# EAGLE design cpu_base (EAGLE 9.0.0)

## Sheet 1 of 2
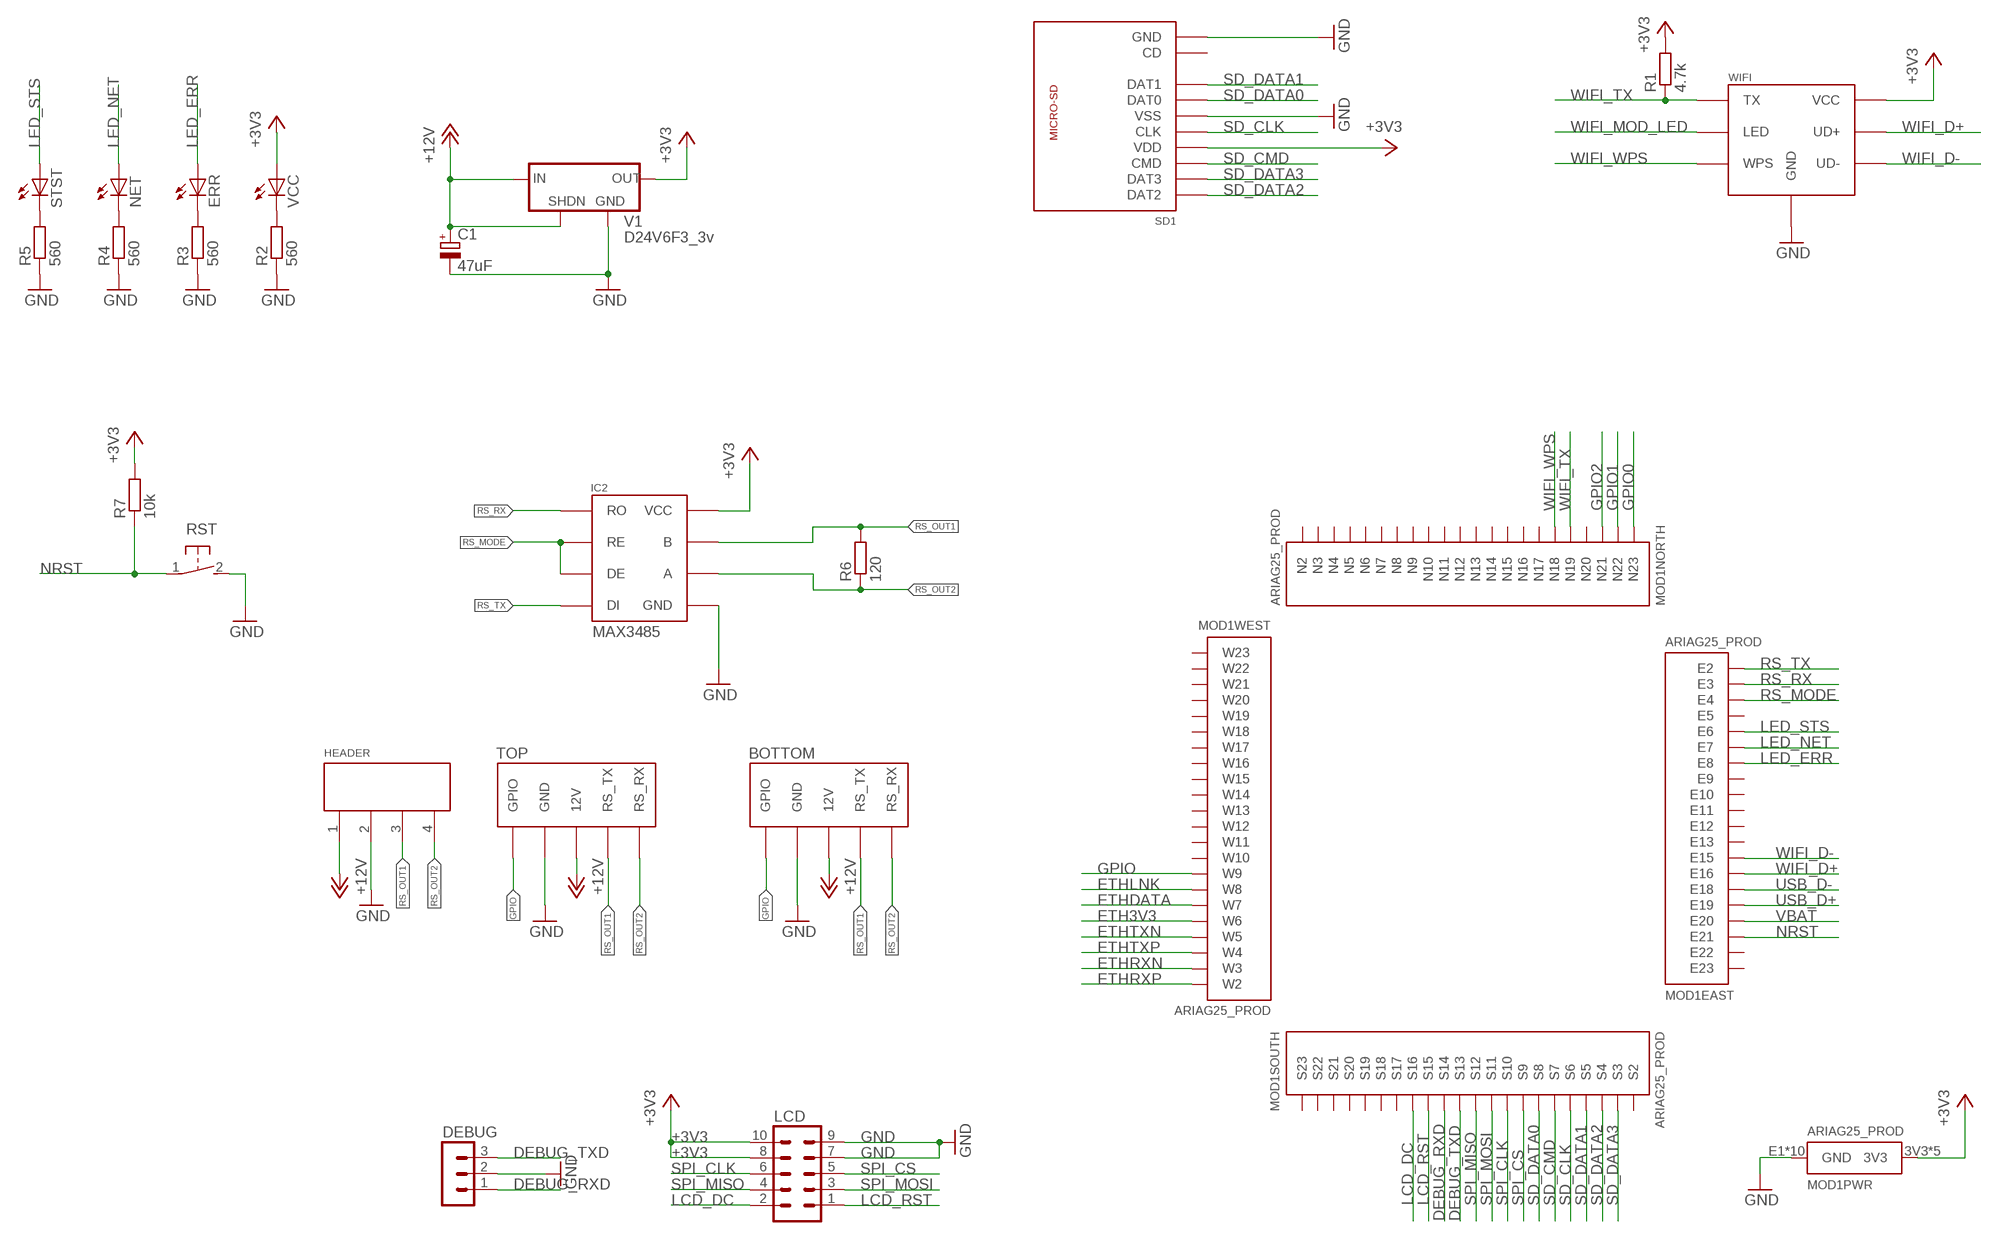
[diagram p0: schematic, sheet 1]

### Parts
BOTTOM  STEROWNIK-PINY_5PIN_BOTTOM  [STEROWNIK-PINY_5PIN_BOTTOM]
C1  47uF  CPOL-EU153CLV-0810  [153CLV-0810]
DEBUG  MA03-1  [MA03-1]
ERR  LEDCHIPLED_0805  [CHIPLED_0805]
HEADER  TBMP5104RO-KF  [TBMP5104RO-KF]
IC2  MAX3485  [SO-8]
LCD  MA05-2  [MA05-2]
MOD1  ARIAG25_PROD  [G25_D]
NET  LEDCHIPLED_0805  [CHIPLED_0805]
R1  4.7k  R-EU_R0805  [R0805]
R2  560  R-EU_R0805  [R0805]
R3  560  R-EU_R0805  [R0805]
R4  560  R-EU_R0805  [R0805]
R5  560  R-EU_R0805  [R0805]
R6  120  R-EU_R0805  [R0805]
R7  10k  R-EU_R0805  [R0805]
RST  31-XX  [B3F-31XX]
SD1  MICRO-SD  [112I-TDAR-R]
STST  LEDCHIPLED_0805  [CHIPLED_0805]
TOP  STEROWNIK-PINY_5PIN  [STEROWNIK-PINY_5PIN]
V1  D24V6F3_3v  D24V6F5_5V  [D24V6F5_5V]
VCC  LEDCHIPLED_0805  [CHIPLED_0805]
WIFI  WIFI-2-OEM  [WIFI]

### Nets
+3V3: IC2.VCC LCD.8 LCD.10 MOD1.3V3(PWR:3V3) MOD1.E24(PWR:3V3) MOD1.N1(PWR:3V3) MOD1.S1(PWR:3V3) MOD1.W24(PWR:3V3) R1.2 R7.2 SD1.4(VDD) V1.VOUT(OUT) VCC.A WIFI.VCC
+12V: BOTTOM.12(12V) C1.+ HEADER.1 TOP.12V V1.SHDN V1.VIN(IN)
DEBUG_RXD: DEBUG.1 MOD1.S14(SOUTH:S14)
DEBUG_TXD: DEBUG.3 MOD1.S13(SOUTH:S13)
ETH3V3: MOD1.W6(WEST:W6)
ETHDATA: MOD1.W7(WEST:W7)
ETHLNK: MOD1.W8(WEST:W8)
ETHRXN: MOD1.W3(WEST:W3)
ETHRXP: MOD1.W2(WEST:W2)
ETHTXN: MOD1.W5(WEST:W5)
ETHTXP: MOD1.W4(WEST:W4)
GND: BOTTOM.GND C1.- DEBUG.2 HEADER.2 IC2.GND LCD.7 LCD.9 MOD1.E1(PWR:GND) MOD1.E14(PWR:GND) MOD1.E17(PWR:GND) MOD1.GND@1(PWR:GND) MOD1.GND@2(PWR:GND) MOD1.GND@4(PWR:GND) MOD1.GND@5(PWR:GND) MOD1.N24(PWR:GND) MOD1.S24(PWR:GND) MOD1.W1(PWR:GND) R2.1 R3.1 R4.1 R5.1 RST.2(S) SD1.6(VSS) SD1.GND_A(GND) SD1.GND_B(GND) SD1.GND_C(GND) TOP.GND V1.GND WIFI.GND
GPIO: BOTTOM.GPIO1(GPIO) MOD1.W9(WEST:W9) TOP.GPIO1(GPIO)
GPIO0: MOD1.N23(NORTH:N23)
GPIO1: MOD1.N22(NORTH:N22)
GPIO2: MOD1.N21(NORTH:N21)
LCD_DC: LCD.2 MOD1.S16(SOUTH:S16)
LCD_RST: LCD.1 MOD1.S15(SOUTH:S15)
LED_ERR: ERR.A MOD1.E8(EAST:E8)
LED_NET: MOD1.E7(EAST:E7) NET.A
LED_STS: MOD1.E6(EAST:E6) STST.A
N$6: R2.2 VCC.C
N$7: ERR.C R3.2
N$9: NET.C R4.2
N$10: R5.2 STST.C
NRST: MOD1.E21(EAST:E21) R7.1 RST.1(P)
RS_MODE: IC2.DE IC2.RE MOD1.E4(EAST:E4)
RS_OUT1: BOTTOM.RS_TX HEADER.3 IC2.B R6.2 TOP.RS_TX
RS_OUT2: BOTTOM.RS_RX HEADER.4 IC2.A R6.1 TOP.RS_RX
RS_RX: IC2.RO MOD1.E3(EAST:E3)
RS_TX: IC2.DI MOD1.E2(EAST:E2)
SD_CLK: MOD1.S6(SOUTH:S6) SD1.5(CLK)
SD_CMD: MOD1.S7(SOUTH:S7) SD1.3(CMD)
SD_DATA0: MOD1.S8(SOUTH:S8) SD1.7(DAT0)
SD_DATA1: MOD1.S5(SOUTH:S5) SD1.8(DAT1)
SD_DATA2: MOD1.S4(SOUTH:S4) SD1.1(DAT2)
SD_DATA3: MOD1.S3(SOUTH:S3) SD1.2(DAT3)
SPI_CLK: LCD.6 MOD1.S10(SOUTH:S10)
SPI_CS: LCD.5 MOD1.S9(SOUTH:S9)
SPI_MISO: LCD.4 MOD1.S12(SOUTH:S12)
SPI_MOSI: LCD.3 MOD1.S11(SOUTH:S11)
USB_D+: MOD1.E19(EAST:E19)
USB_D-: MOD1.E18(EAST:E18)
VBAT: MOD1.E20(EAST:E20)
WIFI_D+: MOD1.E16(EAST:E16) WIFI.UD+
WIFI_D-: MOD1.E15(EAST:E15) WIFI.UD-
WIFI_MOD_LED: WIFI.LED
WIFI_TX: MOD1.N19(NORTH:N19) R1.1 WIFI.TX
WIFI_WPS: MOD1.N18(NORTH:N18) WIFI.WPS
Unconnected: MOD1.E5(EAST:E5) MOD1.E9(EAST:E9) MOD1.E10(EAST:E10) MOD1.E11(EAST:E11) MOD1.E12(EAST:E12) MOD1.E13(EAST:E13) MOD1.E22(EAST:E22) MOD1.E23(EAST:E23) MOD1.N2(NORTH:N2) MOD1.N3(NORTH:N3) MOD1.N4(NORTH:N4) MOD1.N5(NORTH:N5) MOD1.N6(NORTH:N6) MOD1.N7(NORTH:N7) MOD1.N8(NORTH:N8) MOD1.N9(NORTH:N9) MOD1.N10(NORTH:N10) MOD1.N11(NORTH:N11) MOD1.N12(NORTH:N12) MOD1.N13(NORTH:N13) MOD1.N14(NORTH:N14) MOD1.N15(NORTH:N15) MOD1.N16(NORTH:N16) MOD1.N17(NORTH:N17) MOD1.N20(NORTH:N20) MOD1.S2(SOUTH:S2) MOD1.S17(SOUTH:S17) MOD1.S18(SOUTH:S18) MOD1.S19(SOUTH:S19) MOD1.S20(SOUTH:S20) MOD1.S21(SOUTH:S21) MOD1.S22(SOUTH:S22) MOD1.S23(SOUTH:S23) MOD1.W10(WEST:W10) MOD1.W11(WEST:W11) MOD1.W12(WEST:W12) MOD1.W13(WEST:W13) MOD1.W14(WEST:W14) MOD1.W15(WEST:W15) MOD1.W16(WEST:W16) MOD1.W17(WEST:W17) MOD1.W18(WEST:W18) MOD1.W19(WEST:W19) MOD1.W20(WEST:W20) MOD1.W21(WEST:W21) MOD1.W22(WEST:W22) MOD1.W23(WEST:W23) SD1.CD

### Notes on the sheet
- MAX3485

## Sheet 2 of 2

## Library data of the parts
BOTTOM = pcb:STEROWNIK-PINY_5PIN_BOTTOM
C1 = rcl:CPOL-EU: POLARIZED CAPACITOR, European symbol
DEBUG = con-lstb:MA03-1: PIN HEADER; OC_FARNELL: unknown; OC_NEWARK: unknown
ERR NET STST VCC = led:LED: LED OSRAM: - CHIPLED LG R971, LG N971, LY N971, LG Q971, LY Q971, LO R971, LY R971 LH N974, LH R974 LS Q976, LO Q976, LY Q976 LO Q996 - Hyper CHIPLED LW Q18S LB Q993, LB Q99A, LB R99A - SideLED LS A670, LO A670, LY A670, LG A670, LP A670 LB A673, LV A673, LT A673, LW A673 LH A674 LY A675 LS A676, LA A676, LO A676, LY A676, LW A676 LS A679, LY A679, LG A679 - Hyper Micro SIDELED® LS Y876, LA Y876, LO Y876, LY Y876 LT Y87S - SmartLED LW L88C, LW L88S LB L89C, LB L89S, LG L890 LS L89K, LO L89K, LY L89K LS L896, LA L896, LO L896, LY L896 - TOPLED LS T670, LO T670, LY T670, LG T670, LP T670 LSG T670, LSP T670, LSY T670, LOP T670, LYG T670 LG T671, LOG T671, LSG T671 LB T673, LV T673, LT T673, LW T673 LH T674 LS T676, LA T676, LO T676, LY T676, LB T676, LH T676, LSB T676, LW T676 LB T67C, LV T67C, LT T67C, LS T67K, LO T67K, LY T67K, LW E67C LS E67B, LA E67B, LO E67B, LY E67B, LB E67C, LV E67C, LT E67C LW T67C LS T679, LY T679, LG T679 LS T770, LO T770, LY T770, LG T770, LP T770 LB T773, LV T773, LT T773, LW T773 LH T774 LS E675, LA E675, LY E675, LS T675 LS T776, LA T776, LO T776, LY T776, LB T776 LHGB T686 LT T68C, LB T68C - Hyper Mini TOPLED® LB M676 - Mini TOPLED Santana® LG M470 LS M47K, LO M47K, LY M47K Source: http://www.osram.convergy.de LUXEON: - LUMILED® LXK2-PW12-R00, LXK2-PW12-S00, LXK2-PW14-U00, LXK2-PW14-V00 LXK2-PM12-R00, LXK2-PM12-S00, LXK2-PM14-U00 LXK2-PE12-Q00, LXK2-PE12-R00, LXK2-PE12-S00, LXK2-PE14-T00, LXK2-PE14-U00 LXK2-PB12-K00, LXK2-PB12-L00, LXK2-PB12-M00, LXK2-PB14-N00, LXK2-PB14-P00, LXK2-PB14-Q00 LXK2-PR12-L00, LXK2-PR12-M00, LXK2-PR14-Q00, LXK2-PR14-R00 LXK2-PD12-Q00, LXK2-PD12-R00, LXK2-PD12-S00 LXK2-PH12-R00, LXK2-PH12-S00 LXK2-PL12-P00, LXK2-PL12-Q00, LXK2-PL12-R00 Source: www.luxeon.com KINGBRIGHT: KA-3528ASYC Source: www.kingbright.com
HEADER = con-kaifeng-508:TBMP5104RO-KF
IC2 = MAX3485ESA:MAX3485
LCD = con-lstb:MA05-2: PIN HEADER; OC_FARNELL: unknown; OC_NEWARK: unknown
MOD1 = ariag25_pelicella:ARIAG25_PROD: Aria G25 - Low cost Linux Embedded SMD module ISTRUZIONI PER IL MONTAGGIO Per il telaio serigrafico lo spessore è 120 micron così si possono montare componenti anche piccoli come gli 0402 vicino all'Aria. Per il montaggio automatico delle Aria: Additional Z move durante il piazzamento: 0.5mm (utile per spingere l'Aria sulla carrier in modo che si adatti a tocchi tutte le PAD con lo stagno. (l'additional Z move infatti è assorbito dalle molle della testa automatica) Tempo di piazzamento: 5 seconds (necessario per permettere all'Aria di toccare perfettamente tutte le PAD stagnate) Altezza Z dell'Aria: 2.7mm Montare le Aria a bassa velocità totale.
R1-R7 = resistor:R-EU_: RESISTOR, European symbol
RST = switch-omron:31-XX: OMRON SWITCH; MPN: B3F-3100; OC_FARNELL: 959704; OC_NEWARK: 36M3582
SD1 = con-attend:MICRO-SD
TOP = pcb:STEROWNIK-PINY_5PIN
V1 = v-reg:D24V6F5_5V
WIFI = WIFI-2-OEM:WIFI-2-OEM

## Net classes
0 default: width 0.406 mm

## Board
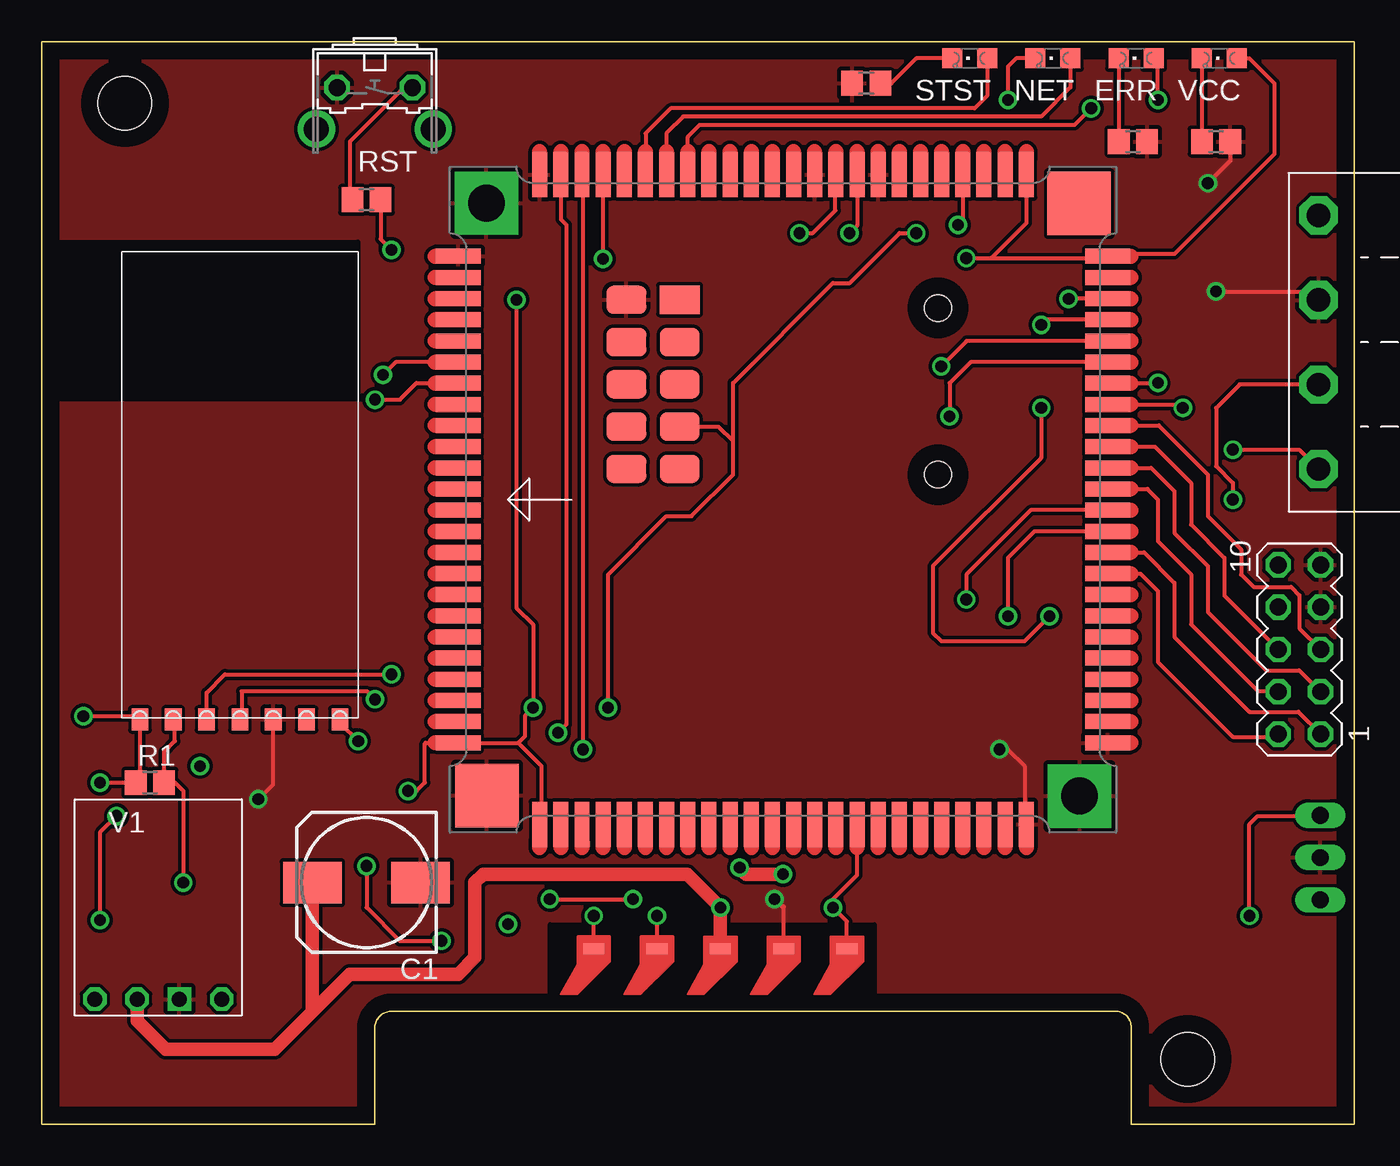
[diagram p1: board, top side]
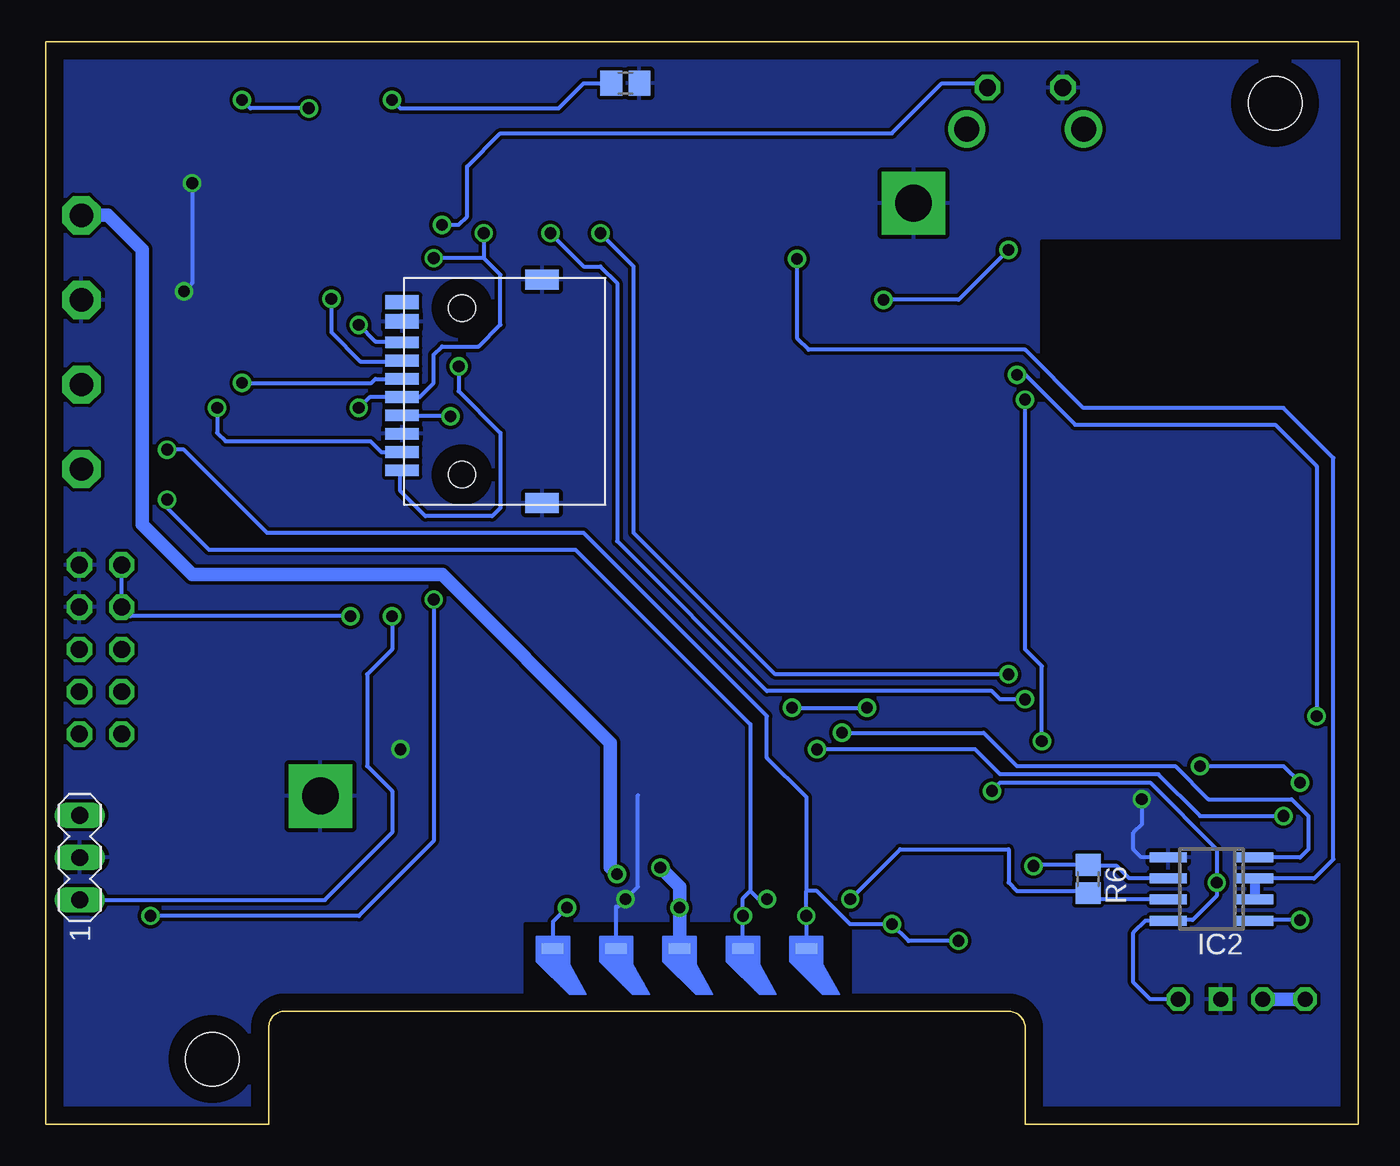
[diagram p2: board, bottom side, seen from below]

Size 78.8 x 65 mm. Coordinates in mm from the lower left corner, seen from the top.
Outline: 78.8,65 0,65 0,0 20,0 20,5.8 arc-90 21.04,6.78 64.44,6.78 arc-90 65.4,5.8 65.4,0 78.8,0 78.8,65
Copper layers (1*16): Top 0.035mm / dielectric 1.5mm / Bottom 0.035mm
Design rules "default": minimum track width 10mil, minimum drill 24mil, track to track 8mil, track to pad 8mil, pad to pad 8mil, via to via 8mil, smd to smd 8mil, copper to edge 40mil, drill to drill 8mil, minimum pad ring 10mil, minimum via ring 8mil, stop-mask expansion 4mil, vias tented up to drill 0mil, thermal gap 10mil
Holes 3.2 mm at 5,61.3 68.8,3.9
bKeepout: area 38.2,62.6 to 40.6,65; area 0,57 to 5,58.5; area 73.8,57 to 78.8,58.5; area 3.8,0 to 5.2,1.9; area 73.5,0 to 75,1.9

### Footprints (pad centres in the part's own frame; a part is rotated, then mirrored left to right if it is on the bottom)
STEROWNIK-PINY_5PIN_BOTTOM = smd 1.27 x 0.635 bottom: 12 -0.5,1; GND -4.3,1; GPIO1 -8.1,1; RS_RX 7.1,1; RS_TX 3.3,1
153CLV-0810 = smd 3.5 x 2.5: + 3.25,0; - -3.25,0
MA03-1 = drill 1.016 long: 1 -2.54,0; 2 0,0; 3 2.54,0
CHIPLED_0805 = smd 1.2 x 1.2: A 0,-1.05; C 0,1.05
TBMP5104RO-KF = drill 1.4 pad 2.3 octagon: 1 -7.62,0; 2 -2.54,0; 3 2.54,0; 4 7.62,0
SO-8 = smd 2.2 x 0.6: A 2.6,-0.635; B 2.6,0.635; DE -2.6,-0.635; DI -2.6,-1.905; GND 2.6,-1.905; RE -2.6,0.635; RO -2.6,1.905; VCC 2.6,1.905
MA05-2 = drill 1.016 octagon: 1 -5.08,-1.27; 2 -5.08,1.27; 3 -2.54,-1.27; 4 -2.54,1.27; 5 0,-1.27; 6 0,1.27; 7 2.54,-1.27; 8 2.54,1.27; 9 5.08,-1.27; 10 5.08,1.27
G25_D = smd 1.7 x 2.4: 3V3 4.38,6.2; GND@5 12,9.4; P$2 9.46,9.4; P$3 6.92,9.4; P$4 4.38,9.4; P$5 1.84,9.4; P$6 12,6.2; P$7 9.46,6.2; P$8 6.92,6.2; P$10 1.84,6.2 | smd 2.7 x 0.9: E1 19.5,14.605; E2 19.5,13.335; E3 19.5,12.065; E4 19.5,10.795; E5 19.5,9.525; E6 19.5,8.255; E7 19.5,6.985; E8 19.5,5.715; E9 19.5,4.445; E10 19.5,3.175; E11 19.5,1.905; E12 19.5,0.635; E13 19.5,-0.635; E14 19.5,-1.905; E15 19.5,-3.175; E16 19.5,-4.445; E17 19.5,-5.715; E18 19.5,-6.985; E19 19.5,-8.255; E20 19.5,-9.525; E21 19.5,-10.795; E22 19.5,-12.065; E23 19.5,-13.335; E24 19.5,-14.605; W1 -19.5,-14.605; W2 -19.5,-13.335; W3 -19.5,-12.065; W4 -19.5,-10.795; W5 -19.5,-9.525; W6 -19.5,-8.255; W7 -19.5,-6.985; W8 -19.5,-5.715; W9 -19.5,-4.445; W10 -19.5,-3.175; W11 -19.5,-1.905; W12 -19.5,-0.635; W13 -19.5,0.635; W14 -19.5,1.905; W15 -19.5,3.175; W16 -19.5,4.445; W17 -19.5,5.715; W18 -19.5,6.985; W19 -19.5,8.255; W20 -19.5,9.525; W21 -19.5,10.795; W22 -19.5,12.065; W23 -19.5,13.335; W24 -19.5,14.605 | smd 3.81 x 3.81: GND@1 -17.78,17.78; P$9 17.78,-17.78 | drill 2.2 pad 3.81 square: GND@2 17.8,17.8; GND@4 -17.8,-17.8 | smd 0.9 x 2.7: N1 -14.605,19.5; N2 -13.335,19.5; N3 -12.065,19.5; N4 -10.795,19.5; N5 -9.525,19.5; N6 -8.255,19.5; N7 -6.985,19.5; N8 -5.715,19.5; N9 -4.445,19.5; N10 -3.175,19.5; N11 -1.905,19.5; N12 -0.635,19.5; N13 0.635,19.5; N14 1.905,19.5; N15 3.175,19.5; N16 4.445,19.5; N17 5.715,19.5; N18 6.985,19.5; N19 8.255,19.5; N20 9.525,19.5; N21 10.795,19.5; N22 12.065,19.5; N23 13.335,19.5; N24 14.605,19.5; S1 14.605,-19.5; S2 13.335,-19.5; S3 12.065,-19.5; S4 10.795,-19.5; S5 9.525,-19.5; S6 8.255,-19.5; S7 6.985,-19.5; S8 5.715,-19.5; S9 4.445,-19.5; S10 3.175,-19.5; S11 1.905,-19.5; S12 0.635,-19.5; S13 -0.635,-19.5; S14 -1.905,-19.5; S15 -3.175,-19.5; S16 -4.445,-19.5; S17 -5.715,-19.5; S18 -6.985,-19.5; S19 -8.255,-19.5; S20 -9.525,-19.5; S21 -10.795,-19.5; S22 -12.065,-19.5; S23 -13.335,-19.5; S24 -14.605,-19.5
R0805 = smd 1.3 x 1.5: 1 -0.85,0; 2 0.85,0
B3F-31XX = drill 1.016 octagon: 1 -2.261,-1.245; 2 2.261,-1.245 | drill 1.499 pad 2.159: 3 -3.505,1.245; 4 3.505,1.245
112I-TDAR-R = smd 0.7 x 2: 1 2.95,3.4; 2 1.85,3.4; 3 0.75,3.4; 4 -0.35,3.4; 5 -1.45,3.4; 6 -2.55,3.4; 7 -3.65,3.4; 8 -4.75,3.4 | smd 0.85 x 2: CD 5.35,3.4; GND_C 4.2,3.4 | smd 1.2 x 2: GND_A -6.7,-5; GND_B 6.7,-5 | hole 1.6: -5,-0.2; 5,-0.2
STEROWNIK-PINY_5PIN = smd 1.27 x 0.635: 12V -0.508,1.016; GND -4.318,1.016; GPIO1 -8.128,1.016; RS_RX 7.112,1.016; RS_TX 3.302,1.016
D24V6F5_5V = drill 0.9 square: GND 1.27,0 | drill 0.9 octagon: SHDN -3.81,0; VIN -1.27,0; VOUT 3.81,0
WIFI = smd 1.3 x 1: GND -14.2,-2.4; LED -14.2,-4.4; TX -14.2,5.6; UD+ -14.2,-0.4; UD- -14.2,1.6; VCC -14.2,3.6; WPS -14.2,-6.4

### Placement (x,y rotation side)
BOTTOM  40.24,9.53 0 bottom
C1  19.5,14.5 180 top
DEBUG  76.75,16 90 bottom
ERR  65.7,64 90 top
HEADER  76.65,46.95 270 top
IC2  8.81,14.12 180 bottom
LCD  75.5,28.5 90 top
MOD1  44.5,37.5 90 top
NET  60.7,64 90 top
R1  6.5,20.5 0 top
R2  70.5,59 180 top
R3  65.5,59 180 top
R4  44,62.5 180 bottom
R5  49.5,62.5 0 top
R6  16.21,14.71 270 bottom
R7  19.5,55.5 0 top
RST  20,61 180 top
SD1  54,44 90 bottom
STST  55.7,64 90 top
TOP  40.24,9.53 0 bottom
V1  7,7.5 0 top
VCC  70.7,64 90 top
WIFI  11.5,38.5 90 top

### Tracks (layer width: path | path; a pad name or v marks a point on that pad's centre or on a via)
+3V3  (via drill 0.7)
  Top 0.254: 57,52 63.9,52 MOD1.S1 64.11,52 65,52 65.25,52.25 68,52.25 74,58.25 74,62.5 72.5,64 VCC.A | WIFI.VCC 8,24.2 8,23 7.35,22.35 R1.2 8,20.5 8.5,20 v8.5,14.5 | 28.61,22.89 MOD1.N1 23.05,22.9 23,22.85 23,20.5 22.5,20 v22,20 | 28.61,22.89 30,21.5 30,18.11 MOD1.W24 | MOD1.E24 59.1,54.1 57,52 | v55.5,52 57,52 | MOD1.3V3 40.62,41.88 41.5,41 | 28.61,22.89 29,23.29 29,24.5 v29.5,25 29.5,30 28.5,31 v28.5,49.5 | 41.5,41 41.5,44.5 47.5,50.5 48.5,50.5 51.5,53.5 v52.5,53.5 | v34,25 34,33 37.5,36.5 39,36.5 41.5,39 41.5,41 | v60,43 60,40 53.5,33.5 53.5,29.5 54,29 59,29 v60.5,30.5 | R7.2 20.35,53.15 v21,52.5
  Bottom 0.254: V1.VOUT 12.5,7.5 13.5,8.5 13.5,11.5 12.79,12.21 IC2.VCC 11.38,12.25 9.95,12.25 8.5,13.7 v8.5,14.5 8.5,16.5 12.5,20.5 21.5,20.5 v22,20 | 52.5,52 51.5,51 51.5,48 52.8,46.7 55,46.7 55.5,46.2 55.5,44.5 56.35,43.65 SD1.4 59.35,43.65 v60,43 | 52.5,52 v55.5,52 | v34,25 v29.5,25 | v52.5,53.5 52.5,52 | v60.5,30.5 73.69,30.5 LCD.8 LCD.10 | v21,52.5 24,49.5 v28.5,49.5
+12V  (via drill 0.7)
  Top 0.813: BOTTOM.12 v40.74,12.99 v40.75,13 38.75,15 26.5,15 26,14.5 26,10 25,9 18.5,9 16.25,6.75 | C1.+ 16.25,6.75 | 16.25,6.75 14,4.5 7.45,4.5 5.75,6.2 5.75,7.48 V1.VIN | v44.5,15 42.3,15 v41.9,15.4
  Bottom 0.813: TOP.12V v40.75,13 40.75,14.25 v41.9,15.4 | HEADER.1 75.07,54.57 73,52.5 73,36 70,33 55,33 44.9,22.9 44.9,15.4 v44.5,15 | V1.VIN V1.SHDN
DEBUG_RXD  (via drill 0.7)
  Top 0.254: MOD1.S14 59.59,35.59 58,34 v58,30.5
  Bottom 0.254: v58,30.5 58,28.5 59.5,27 59.5,21.5 58,20 58,17.5 62.04,13.46 DEBUG.1
DEBUG_TXD  (via drill 0.7)
  Top 0.254: MOD1.S13 59.37,36.87 55.5,33 v55.5,31.5 | v72.5,12.5 72.5,18 73,18.5 76.71,18.5 DEBUG.3
  Bottom 0.254: v55.5,31.5 55.5,17 60,12.5 v72.5,12.5
GND  (via drill 0.7)
  Top 0.254: v13,19.5 13.9,20.4 WIFI.GND | 22.5,14.75 C1.- | 50.25,56.97 MOD1.E17 | BOTTOM.GND 44.56,10.53 44.56,13.06 44.44,13.06 v44,13.5 | v57.5,22.5 58,22.5 59,21.5 59,18.11 MOD1.W1 | R2.1 71.35,57.85 v70,56.5 | v70.5,50 76.14,50 HEADER.2
  Bottom 0.254: IC2.GND 13.03,16.02 13.5,16.5 13.5,17.5 13,18 v13,19.5 | TOP.GND 44.56,13.06 44.44,13.06 v44,13.5 43.25,14.25 43.25,19.75 | v70,56.5 70,50.5 v70.5,50
  pour Bottom: 0,0 0,65 79,65 79.5,0
  pour Top: 0,0 0,65 79,65 79,0
GPIO  (via drill 0.7)
  Top 0.254: MOD1.W9 49,17.95 49,17.5 48.95,17.45 48.95,14.95 47.5,13.5 v47.5,13 48.34,12.16 BOTTOM.GPIO1
  Bottom 0.254: 48.5,10.55 TOP.GPIO1 48.35,10.56 48.35,12.15 v47.5,13
LCD_DC
  Top 0.254: MOD1.S16 65.94,33.05 67,32 67,27.75 71.5,23.25 74.06,23.25 LCD.2
LCD_RST
  Top 0.254: MOD1.S15 66.17,34.33 68,32.5 68,29.25 72.5,24.75 75.44,24.75 LCD.1
LED_ERR  (via drill 0.7)
  Top 0.254: MOD1.E8 38.78,59.28 39.5,60 62,60 v63,61 | v67,61.5 67,63.75 ERR.A
  Bottom 0.254: v63,61 66.5,61 v67,61.5
LED_NET
  Top 0.254: NET.A 61.75,62.25 60,60.5 38.5,60.5 37.5,59.5 37.5,57.02 MOD1.E7
LED_STS
  Top 0.254: STST.A 56.75,61.75 56,61 37.75,61 36.25,59.5 MOD1.E6
N$1
  cutout Top: 30.5,7 30.5,12 50,12 50,7
N$2
  cutout Bottom: 20,0 20,7 65.5,7 65.5,0
N$3
  cutout Bottom: 30.5,7 30.5,12 50,12 50,7
N$4
  cutout Bottom: 0.5,53 19,53 19,43.5 0,43.5 0,53
N$5
  cutout Top: 0,43.5 0,53 19,53 19,43.5
N$6
  Top 0.254: VCC.C R2.2
N$7
  Top 0.254: ERR.C R3.2
N$9  (via drill 0.7)
  Top 0.254: NET.C 58.5,64 58,63.5 v58,61.5
  Bottom 0.254: v58,61.5 57.5,61 48,61 46.5,62.5 R4.2
N$10
  Top 0.254: STST.C 52.5,64 51,62.5 R5.2
NRST  (via drill 0.7)
  Top 0.254: MOD1.E21 55.3,54.3 v55,54 | RST.1 21.75,62.24 18.5,59 18.5,55.65 R7.1
  Bottom 0.254: v55,54 54,54 53.5,54.5 53.5,57.5 51.5,59.5 28,59.5 25,62.5 22.52,62.5 RST.1
RS_MODE  (via drill 0.7)
  Top 0.254: v33.7,51.95 MOD1.E4
  Bottom 0.254: IC2.DE 2.65,14.75 1.5,15.9 1.5,40 4.5,43 16.5,43 20,46.5 33,46.5 33.7,47.2 v33.7,51.95
  Bottom 0.61: IC2.DE IC2.RE
RS_OUT1  (via drill 0.7)
  Top 0.254: HEADER.3 71.91,44.41 70.5,43 70.5,39.5 71.5,38.5 v71.5,37.5 | v30.5,13.5 v35.5,13.5 | BOTTOM.RS_TX v36.94,12.5
  Bottom 0.254: IC2.B 15.84,13.48 R6.2 16.35,14 20.5,14 21,14.5 21,16.5 27.5,16.5 v30.5,13.5 | TOP.RS_TX v36.94,12.5 36.94,13.56 36.5,14 | 36.5,14 36.5,24 47,34.5 69,34.5 71.5,37 v71.5,37.5 | v35.5,13.5 36,13.5 36.5,14
RS_OUT2  (via drill 0.7)
  Top 0.254: v19.5,15.5 19.5,13 21.5,11 v24,11 | v71.5,40.5 75.48,40.5 HEADER.4 | BOTTOM.RS_RX v33.14,12.5
  Bottom 0.254: IC2.A 13.76,14.76 14.5,15.5 16.15,15.5 R6.1 19.43,15.56 v19.5,15.5 | v71.5,40.5 70.5,40.5 65.5,35.5 46.5,35.5 35.5,24.5 35.5,22 33.14,19.64 33.14,14 | TOP.RS_RX v33.14,12.5 33.14,14 | 33.14,14 32.5,14 30.5,12 v28,12 27,11 v24,11
RS_RX  (via drill 0.7)
  Top 0.254: v32.5,22.5 32.5,56.94 MOD1.E3 | v4.5,18.5 3.5,17.5 v3.5,12.25
  Bottom 0.254: v4.5,18.5 9.5,18.5 12,21 21.5,21 23,22.5 v32.5,22.5 | v3.5,12.25 6.18,12.25 IC2.RO
RS_TX  (via drill 0.7)
  Top 0.254: MOD1.E2 31.16,54.34 31.5,54 31.5,24 v31,23.5
  Bottom 0.254: v31,23.5 22.5,23.5 20.5,21.5 11,21.5 9,19.5 4,19.5 3,18.5 3,16.5 3.5,16 6.19,16 IC2.DI
SD_CLK  (via drill 0.7)
  Top 0.254: MOD1.S6 55.76,45.76 54.5,44.5 v54.5,42.5
  Bottom 0.254: v54.5,42.5 57.35,42.5 SD1.5
SD_CMD  (via drill 0.7)
  Top 0.254: MOD1.S7 66.98,44.48 v67,44.5
  Bottom 0.254: v67,44.5 59.25,44.5 59,44.75 SD1.3
SD_DATA0  (via drill 0.7)
  Top 0.254: MOD1.S8 68.28,43.22 v68.5,43
  Bottom 0.254: SD1.7 58.65,40.35 59.3,41 68,41 68.5,41.5 v68.5,43
SD_DATA1  (via drill 0.7)
  Top 0.254: MOD1.S5 55.52,47.02 v54,45.5
  Bottom 0.254: v54,45.5 54,44 51.5,41.5 51.5,37 52,36.5 56,36.5 57.5,38 57.5,39.15 SD1.8
SD_DATA2  (via drill 0.7)
  Top 0.254: MOD1.S4 60.3,48.3 v60,48
  Bottom 0.254: v60,48 59,47 57.45,47 SD1.1
SD_DATA3  (via drill 0.7)
  Top 0.254: MOD1.S3 61.66,49.56 v61.65,49.55
  Bottom 0.254: v61.65,49.55 61.65,47.55 59.9,45.8 57.45,45.8 SD1.2
SPI_CLK
  Top 0.254: MOD1.S10 66.83,40.67 69,38.5 69,36 71,34 71,31.73 LCD.6
SPI_CS
  Top 0.254: MOD1.S9 67.06,41.95 70,39 70,36.5 72,34.5 72,33 72.75,32.25 75,32.25 75.5,31.75 75.5,29.77 LCD.5
SPI_MISO
  Top 0.254: MOD1.S12 66.36,38.13 67,37.5 67,35 69,33 69,30 73,26 74.19,26 LCD.4
SPI_MOSI
  Top 0.254: MOD1.S11 66.59,39.41 68,38 68,35.5 70,33.5 70,30.75 73.5,27.25 75.48,27.25 LCD.3
WIFI_D+  (via drill 0.7)
  Top 0.254: MOD1.E16 48.95,53.95 v48.5,53.5 | WIFI.UD+ 12,24.4 12,26 19.5,26 v20,25.5
  Bottom 0.254: v48.5,53.5 46.5,51.5 45.5,51.5 44.5,50.5 44.5,35 35.5,26 22,26 21.5,25.5 v20,25.5
WIFI_D-  (via drill 0.7)
  Top 0.254: WIFI.UD- 9.9,25.9 11,27 v21,27 | v45.5,53.5 46.3,53.5 47.65,54.85 47.65,56.98 MOD1.E15
  Bottom 0.254: v21,27 35,27 43.5,35.5 43.5,51.5 v45.5,53.5
WIFI_TX  (via drill 0.7)
  Top 0.254: WIFI.TX 5.9,20.75 R1.1 v3.5,20.5 | MOD1.N19 21.25,45.76 v20.5,45 | 5.95,24.35 WIFI.TX | v2.5,24.5 5.7,24.5 WIFI.TX
  Bottom 0.254: v9.5,21.5 4.5,21.5 v3.5,20.5 | v2.5,24.5 2.5,39.5 5,42 17,42 20,45 v20.5,45
WIFI_WPS  (via drill 0.7)
  Top 0.254: WIFI.WPS 17.9,24.1 v19,23 | v20,43.5 21.5,43.5 22.5,44.5 24.98,44.5 MOD1.N18
  Bottom 0.254: v19,23 19,27.5 20,28.5 v20,43.5